# EAGLE design fisk-batt-5 (EAGLE 7.6.0)
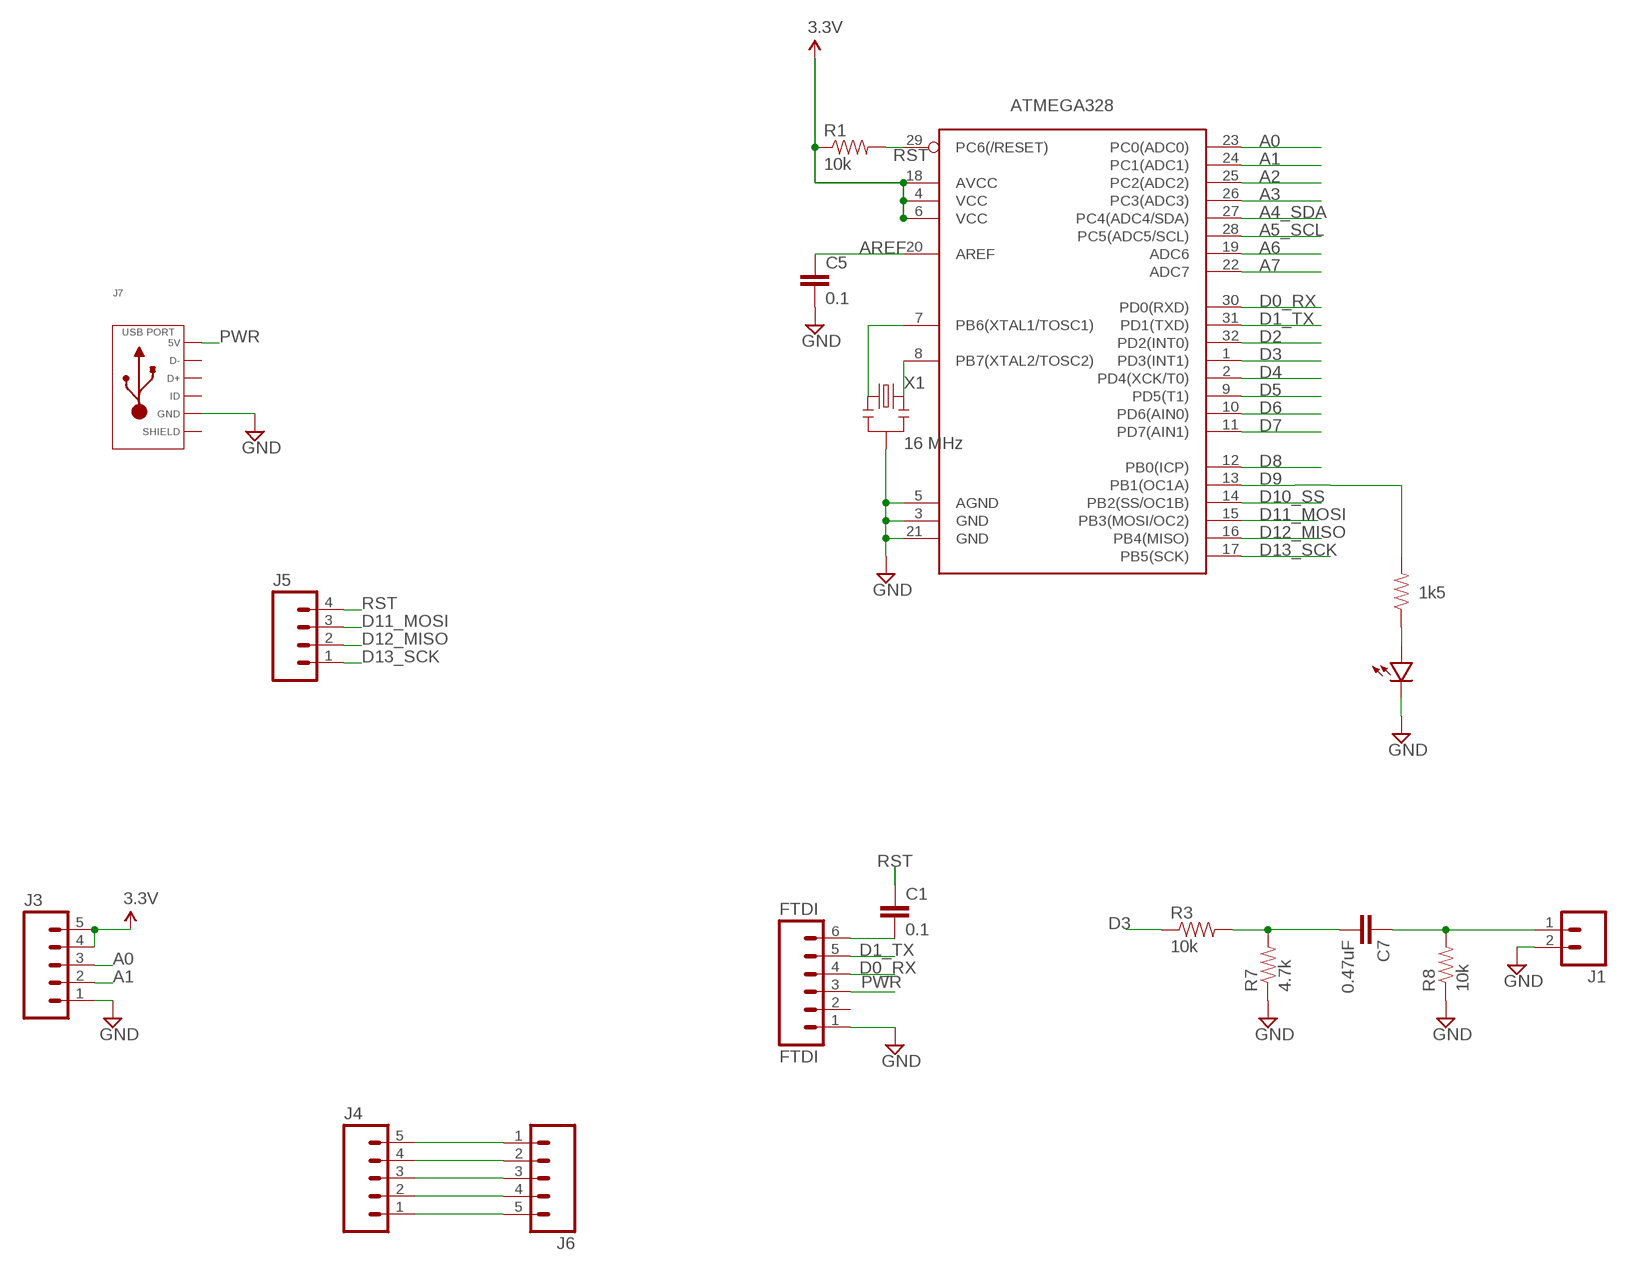
[diagram p0: schematic, sheet 1, part 1 of 2]
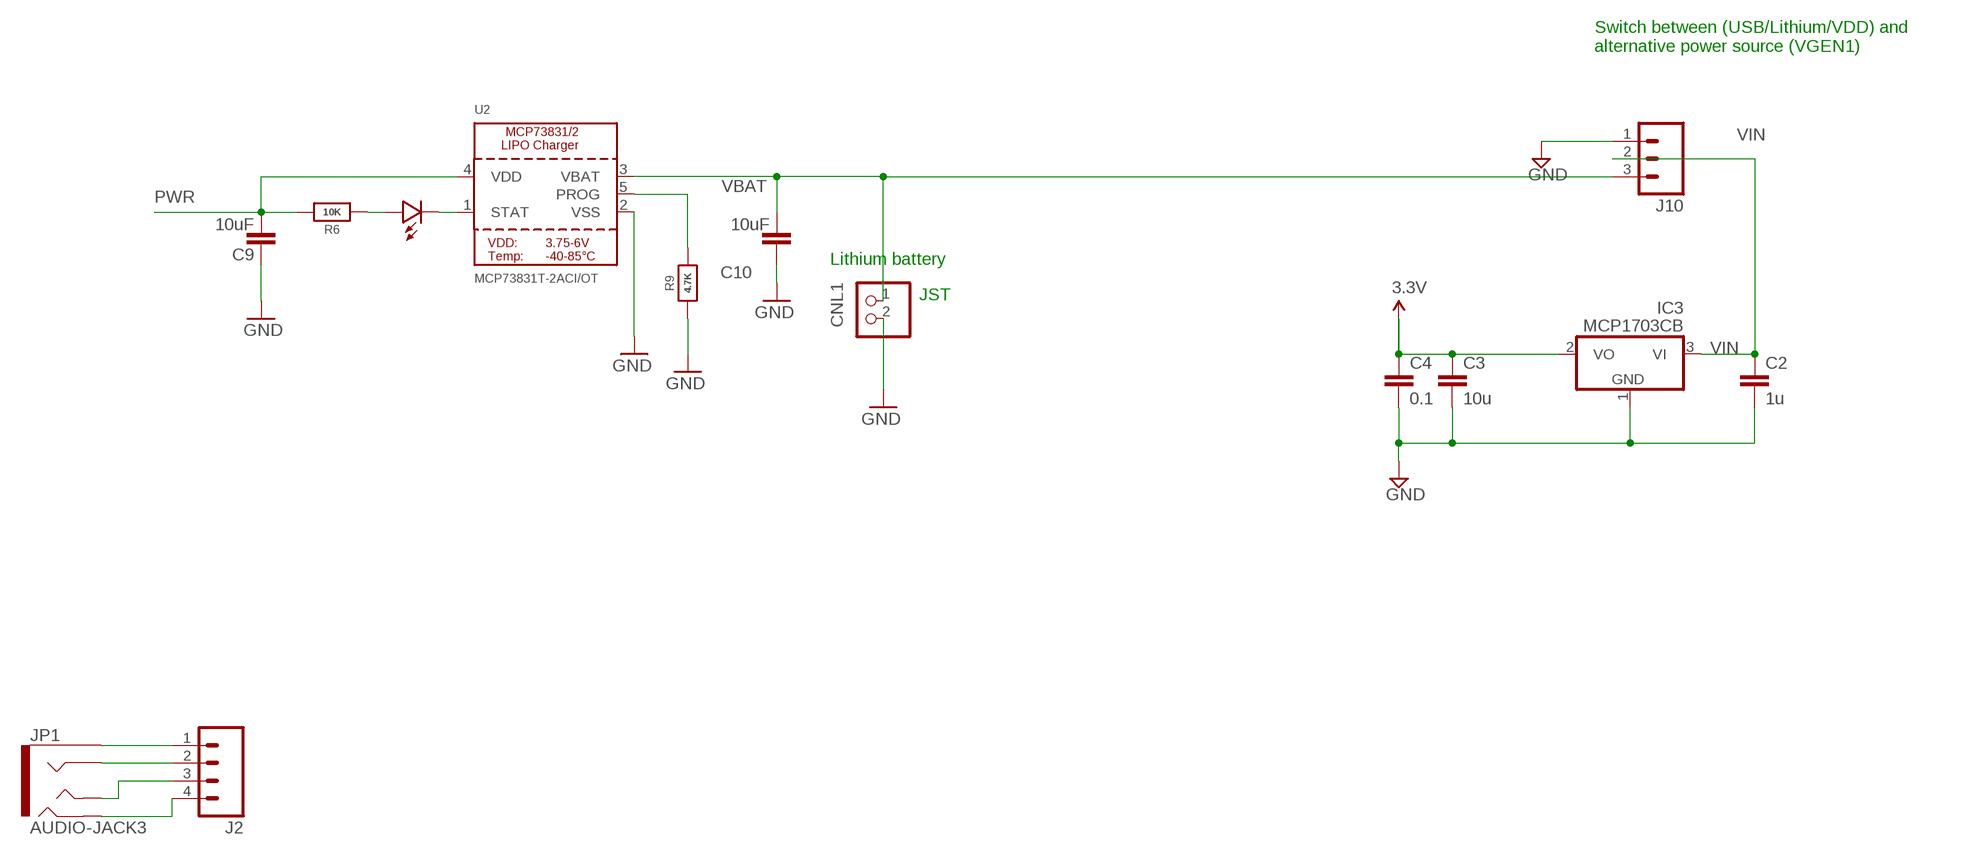
[diagram p1: schematic, sheet 1, part 2 of 2]

## Parts
ATMEGA328  ATMega-328  ATMEGA168/328TQFP32  [TQFP32-08]
C1  0.1  CAP0603-CAP  [0603-CAP]
C2  1u  CAP0603-CAP  [0603-CAP]
C3  10u  CAP0805-CAP  [0805-CAP]
C4  0.1  CAP0603-CAP  [0603-CAP]
C5  0.1  CAP0603-CAP  [0603-CAP]
C7  0.47uF  CAP0603-CAP  [0603-CAP]
C9  10uF  CAP0603-CAP  [0603-CAP]
C10  10uF  CAP0603-CAP  [0603-CAP]
CNL1  JST_2PIN-SMT-RA  [JST-PH-2-SMT-RA]
D2  LED0603  [0603-LED]
FTDI  FTDI  M06SIP  [1X06]
IC3  MCP1703CB  [SOT23]
J1  M02PTH  [1X02]
J2  M04PTH  [1X04]
J3  M05PTH  [1X05]
J4  M05PTH  [1X05]
J5  M04PTH  [1X04]
J6  M05SCREW  [SCREWTERMINAL-3.5MM-5]
J7  USB_MICRO_RIGHT  [MICROUSB-RIGHT]
J10  M03PTH  [1X03]
JP1  AUDIO-JACK3  [AUDIO-JACK-TRRS-SMD]
R1  10k  RESISTOR0603-RES  [0603-RES]
R2  1k5  RESISTOR0603-RES  [0603-RES]
R3  10k  RESISTOR0603-RES  [0603-RES]
R6  10K  RESISTOR_0603_NOOUT  [0603-NO]
R7  4.7k  RESISTOR0603-RES  [0603-RES]
R8  10k  RESISTOR0603-RES  [0603-RES]
R9  4.7K  RESISTOR_0603_NOOUT  [0603-NO]
U2  MCP73831T-2ACI/OT  MCP73831/2  [SOT23-5]
U$2  LED0603  [0603-LED]
X1  16 MHz  RESONATORSMD  [RESONATOR-SMD]

## Nets
A0: ATMEGA328.23(PC0(ADC0)) J3.3
A1: ATMEGA328.24(PC1(ADC1)) J3.2
A2: ATMEGA328.25(PC2(ADC2))
A3: ATMEGA328.26(PC3(ADC3))
A4_SDA: ATMEGA328.27(PC4(ADC4/SDA))
A5_SCL: ATMEGA328.28(PC5(ADC5/SCL))
A6: ATMEGA328.19(ADC6)
A7: ATMEGA328.22(ADC7)
AREF: ATMEGA328.20(AREF) C5.1
D0_RX: ATMEGA328.30(PD0(RXD)) FTDI.4
D1_TX: ATMEGA328.31(PD1(TXD)) FTDI.5
D2: ATMEGA328.32(PD2(INT0))
D3: ATMEGA328.1(PD3(INT1)) R3.1
D4: ATMEGA328.2(PD4(XCK/T0))
D5: ATMEGA328.9(PD5(T1))
D6: ATMEGA328.10(PD6(AIN0))
D7: ATMEGA328.11(PD7(AIN1))
D8: ATMEGA328.12(PB0(ICP))
D9: ATMEGA328.13(PB1(OC1A)) R2.2
D10_SS: ATMEGA328.14(PB2(SS/OC1B))
D11_MOSI: ATMEGA328.15(PB3(MOSI/OC2)) J5.3
D12_MISO: ATMEGA328.16(PB4(MISO)) J5.2
D13_SCK: ATMEGA328.17(PB5(SCK)) J5.1
GND [power]: ATMEGA328.3(GND) ATMEGA328.5(AGND) ATMEGA328.21(GND) C2.2 C3.2 C4.2 C5.2 C9.2 C10.2 CNL1.2 FTDI.1 IC3.1(GND) J1.2 J3.1 J7.5(GND) J10.1 R7.1 R8.1 R9.1 U2.2(VSS) U$2.MINUS X1.2
N$1: ATMEGA328.7(PB6(XTAL1/TOSC1)) X1.1
N$2: R2.1 U$2.PLUS
N$3: C7.2 R3.2 R7.2
N$4: C7.1 J1.1 R8.2
N$5: J2.1 JP1.EARTH
N$6: J2.2 JP1.RING1
N$7: J2.3 JP1.TIP
N$8: J2.4 JP1.RING2
N$9: J4.5 J6.1
N$10: J4.4 J6.2
N$11: J4.3 J6.3
N$12: J4.2 J6.4
N$13: J4.1 J6.5
N$16: R9.2 U2.5(PROG)
N$17: D2.MINUS U2.1(STAT)
N$18: D2.PLUS R6.1
N$20: C1.2 FTDI.6
N$21: ATMEGA328.8(PB7(XTAL2/TOSC2)) X1.3
PWR [power]: C9.1 FTDI.3 J7.1(5V) R6.2 U2.4(VDD)
RST: ATMEGA328.29(PC6(/RESET)) C1.1 J5.4 R1.2
VBAT [power]: C10.1 CNL1.1 J10.3 U2.3(VBAT)
VCC: ATMEGA328.4(VCC) ATMEGA328.6(VCC) ATMEGA328.18(AVCC) C3.1 C4.1 IC3.2(VO) J3.4 J3.5 R1.1 ; supply symbol labelled 3.3V
VIN: C2.1 IC3.3(VI) J10.2
Unconnected: FTDI.2 J7.2(D-) J7.3(D+) J7.4(ID)

## Notes on the sheet
- Switch between (USB/Lithium/VDD) and 
  alternative power source (VGEN1)
- Lithium battery
- JST

## Power pins joined to a net without a drawn wire
SLD: J7.S1(SLD) J7.S2(SLD) J7.S3(SLD) J7.S4(SLD) J7.S5(SLD) J7.S6(SLD) J7.S7(SLD) J7.S8(SLD)

## Library data of the parts
ATMEGA328 = LowPowerLab:ATMEGA168/328: Atmel 32-pin 8-bit micro, 16k flash.
C1-C5 C7 = LowPowerLab:CAP: Capacitor Standard 0603 ceramic capacitor, and 0.1" leaded capacitor.
C9 C10 = SparkFun:CAP: Capacitor Standard 0603 ceramic capacitor, and 0.1" leaded capacitor.
CNL1 = adafruit:JST_2PIN: JST 2-Pin Connectors of various flavors SMT-RA (S2B-PH-SM4) 4UConnector #17311 SMT (B2B-PH-SM4) THM-RA (S2B-PH) THM (B2B-PH)
D2 U$2 = LowPowerLab:LED
FTDI = SparkFun-Connectors:M06: Header 6 Standard 6-pin 0.1" header. Use with straight break away headers (SKU : PRT-00116), right angle break away headers (PRT-00553), swiss pins (PRT-00743), machine pins (PRT-00117), and female headers (PRT-00115). Molex polarized connector foot print use with SKU : PRT-08094 with associated crimp pins and housings. NOTES ON THE VARIANTS LOCK and LOCK_LONGPADS... This footprint was designed to help hold the alignment of a through-hole component (i.e. 6-pin header) while soldering it into place. You may notice that each hole has been shifted either up or down by 0.005 of an inch from it's more standard position (which is a perfectly straight line). This slight alteration caused the pins (the squares in the middle) to touch the edges of the holes. Because they are alternating, it causes a "brace" to hold the component in place. 0.005 has proven to be the perfect amount of "off-center" position when using our standard breakaway headers. Although looks a little odd when you look at the bare footprint, once you have a header in there, the alteration is very hard to notice. Also, if you push a header all the way into place, it is covered up entirely on the bottom side. This idea of altering the position of holes to aid alignment will be further integrated into the Sparkfun Library for other footprints. It can help hold any component with 3 or more connection pins.
IC3 = linear:MCP1703: 250 mA, 16V, Low Quiescent Current LDO Regulator Source: http://ww1.microchip.com/downloads/en/DeviceDoc/22049b.pdf
J1 = SparkFun-Connectors:M02: Standard 2-pin 0.1" header. Use with - straight break away headers ( PRT-00116) - right angle break away headers (PRT-00553) - swiss pins (PRT-00743) - machine pins (PRT-00117) - female headers (PRT-00115) Molex polarized connector foot print use with: PRT-08233 with associated crimp pins and housings. 2.54_SCREWTERM for use with PRT-10571. 3.5mm Screw Terminal footprints for PRT-08084 5mm Screw Terminal footprints for use with PRT-08432
J2 J5 = SparkFun-Connectors:M04: Header 4 Standard 4-pin 0.1" header. Use with straight break away headers (SKU : PRT-00116), right angle break away headers (PRT-00553), swiss pins (PRT-00743), machine pins (PRT-00117), and female headers (PRT-00115). Molex polarized connector foot print use with SKU : PRT-08231 with associated crimp pins and housings. 1MM SMD Version SKU: PRT-10208; PROD_ID: CONN-09696
J3 J4 = SparkFun-Connectors:M05: Header 5 Standard 5-pin 0.1" header. Use with straight break away headers (SKU : PRT-00116), right angle break away headers (PRT-00553), swiss pins (PRT-00743), machine pins (PRT-00117), and female headers (PRT-00115). Molex polarized connector foot print use with SKU : PRT-08230 with associated crimp pins and housings.
J6 = SparkFun-Connectors:M05: Header 5 Standard 5-pin 0.1" header. Use with straight break away headers (SKU : PRT-00116), right angle break away headers (PRT-00553), swiss pins (PRT-00743), machine pins (PRT-00117), and female headers (PRT-00115). Molex polarized connector foot print use with SKU : PRT-08230 with associated crimp pins and housings.; PROD_ID: Combine 8288+8399
J7 = MF_Connectors:USB: Library: MF_Connectors Description: 5 Pin USB Connectors. SLD is the shield connection. Usually tied to ground through a small ferrite bead.
J10 = SparkFun-Connectors:M03: Header 3 Standard 3-pin 0.1" header. Use with straight break away headers (SKU : PRT-00116), right angle break away headers (PRT-00553), swiss pins (PRT-00743), machine pins (PRT-00117), and female headers (PRT-00115). Molex polarized connector foot print use with SKU : PRT-08232 with associated crimp pins and housings.
JP1 = SparkFun-Connectors:AUDIO-JACK3: Audio jack - 3.5mm TRRS variety - two rings.
R1-R3 R7 R8 = LowPowerLab:RESISTOR: Resistor Basic schematic elements and footprints for 0603, 1206, and PTH resistors.
R6 R9 = microbuilder:RESISTOR: Resistors For new designs, use the packages preceded by an '_' character since they are more reliable: The following footprints should be used on most boards: _0402 - Standard footprint for regular board layouts _0603 - Standard footprint for regular board layouts _0805 - Standard footprint for regular board layouts _1206 - Standard footprint for regular board layouts For extremely tight-pitch boards where space is at a premium, the following 'micro-pitch' footprints can be used (smaller pads, no silkscreen outline, etc.): _0402MP - Micro-pitch footprint for very dense/compact boards _0603MP - Micro-pitch footprint for very dense/compact boards _0805MP - Micro-pitch footprint for very dense/compact boards _1206MP - Micro-pitch footprint for very dense/compact boards
U2 = microbuilder:MCP73831/2: MCP73831/2 LIPO Charger VDD: 3.75 - 6V Temp -40 - 85°C Programmable Charge Rate: 15-500mA NOTE: STAT is a tri-state logic output on the MCP73831 and an open-drain output on the MCP73832. SOT23-5 with 4.2V output and tri-state logic on STAT = MCP73831T-2ACI/OT
X1 = SparkFun:RESONATOR: Resonator Small SMD resonator. This is the itty bitty 10/20MHz resonators with built in caps. CSTCE10M0G55 and CSTCE20M0V53. Footprint has been reviewed closely but hasn't been tested yet.

## Net classes
1 power: width 0.305 mm

## Board
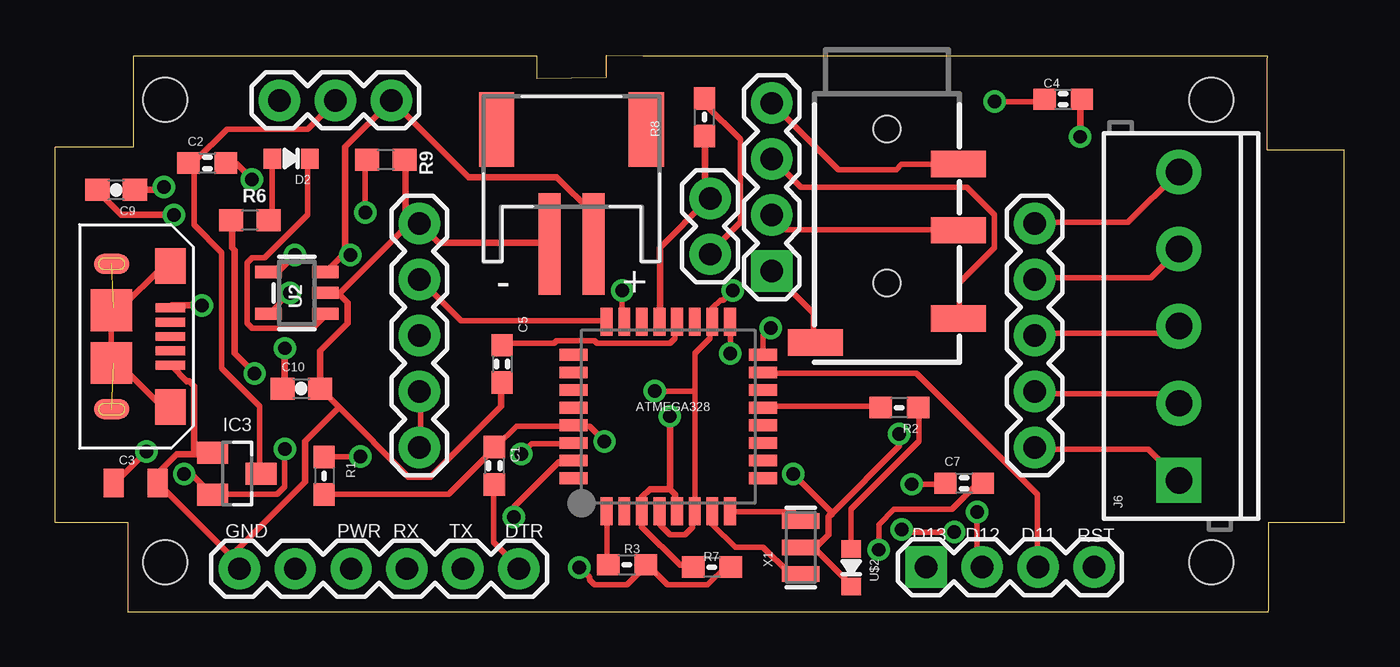
[diagram p2: board, top side]
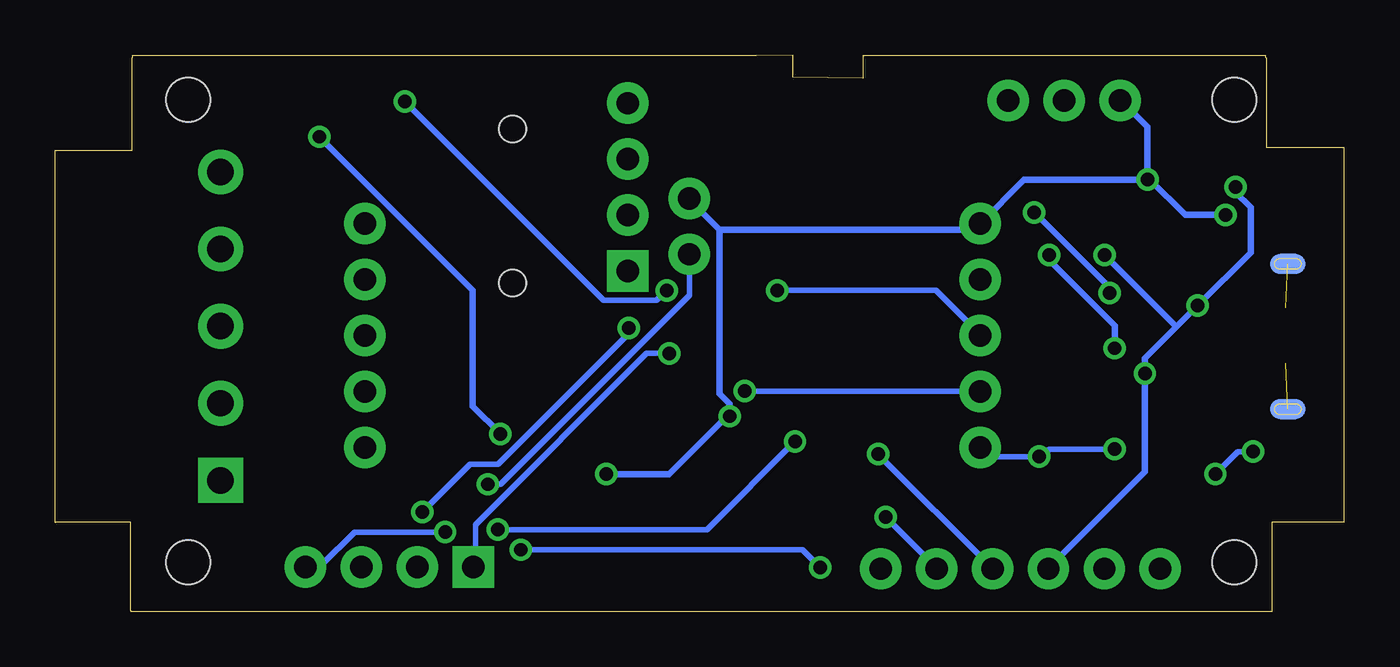
[diagram p3: board, bottom side, seen from below]

Size 58.55 x 25.28 mm. Coordinates in mm from the lower left corner, seen from the top.
Outline: 3.3,0 3.3,4.06 0,4.06 0,21.08 3.56,21.08 3.56,25.15
Outline: 55.12,0.05 55.12,4.06 58.55,4.06
Outline: 58.55,4.06 58.55,4.05
Outline: 3.3,0 55.1,0 55.1,0.05
Outline: 58.55,4.06 58.55,20.95 55.05,20.95 55.05,25.15
Outline: 3.56,25.15 3.56,25.25 21.88,25.25 21.88,24.23 25.05,24.26 25.05,25.28 26.7,25.25 55.05,25.25 55.05,25.15
Copper layers (1*16): Top 0.035mm / dielectric 1.5mm / Bottom 0.035mm
Design rules "default": minimum track width 10mil, minimum drill 24mil, track to track 8mil, track to pad 8mil, pad to pad 8mil, via to via 8mil, smd to smd 8mil, copper to edge 40mil, drill to drill 8mil, minimum pad ring 10mil, minimum via ring 8mil, stop-mask expansion 4mil, vias tented up to drill 0mil, thermal gap 10mil
Holes 2 mm at 5,2.25 5,23.25 52.5,2.25 52.5,23.25

### Footprints (pad centres in the part's own frame; a part is rotated, then mirrored left to right if it is on the bottom)
TQFP32-08 = smd 1.27 x 0.533: 1 -4.293,2.8; 2 -4.293,2; 3 -4.293,1.2; 4 -4.293,0.4; 5 -4.293,-0.4; 6 -4.293,-1.2; 7 -4.293,-2; 8 -4.293,-2.8; 17 4.293,-2.8; 18 4.293,-2; 19 4.293,-1.2; 20 4.293,-0.4; 21 4.293,0.4; 22 4.293,1.2; 23 4.293,2; 24 4.293,2.8 | smd 0.533 x 1.27: 9 -2.8,-4.293; 10 -2,-4.293; 11 -1.2,-4.293; 12 -0.4,-4.293; 13 0.4,-4.293; 14 1.2,-4.293; 15 2,-4.293; 16 2.8,-4.293; 25 2.8,4.293; 26 2,4.293; 27 1.2,4.293; 28 0.4,4.293; 29 -0.4,4.293; 30 -1.2,4.293; 31 -2,4.293; 32 -2.8,4.293
0603-CAP = smd 1.016 x 0.965: 1 -0.85,0; 2 0.85,0
0805-CAP = smd 0.902 x 1.3: 1 -1,0; 2 1,0
0603-CAP' = smd 1.1 x 1: 1 -0.85,0; 2 0.85,0
JST-PH-2-SMT-RA = smd 1 x 4.6: 1 1,-3.7; 2 -1,-3.7 | smd 1.6 x 3.4: NC1 -3.4,1.5; NC2 3.4,1.5
0603-LED = smd 0.8 x 0.9: MINUS -0.85,0; PLUS 0.85,0
1X06 = drill 1.016 pad 1.88: 1 0,0; 2 2.54,0; 3 5.08,0; 4 7.62,0; 5 10.16,0; 6 12.7,0
SOT23 = smd 1 x 1.4: 1 -0.95,-1.1; 2 0.95,-1.1; 3 0,1.1
1X02 = drill 1.016 pad 1.88: 1 0,0; 2 2.54,0
1X04 = drill 1.016 pad 1.88 square: 1 0,0 | drill 1.016 pad 1.88: 2 2.54,0; 3 5.08,0; 4 7.62,0
1X05 = drill 1.016 pad 1.88: 1 0,0; 2 2.54,0; 3 5.08,0; 4 7.62,0; 5 10.16,0
SCREWTERMINAL-3.5MM-5 = drill 1.2 pad 2.032 square: 1 0,0 | drill 1.2 pad 2.032: 2 3.5,0; 3 7,0; 4 10.5,0; 5 14,0
MICROUSB-RIGHT = smd 0.4 x 1.35: 1 -1.3,1.27; 2 -0.65,1.27; 3 0,1.27; 4 0.65,1.27; 5 1.3,1.27 | smd 0.9 x 1.6: S1 -3.3,-1.4; S2 3.3,-1.4 | smd 1.6 x 1.4: S3 -3.2,1.27; S4 3.2,1.27 | smd 1.9 x 1.9: S5 -1.2,-1.405; S6 1.2,-1.405 | smd 0.9 x 1.6 bottom: S7 -3.3,-1.4; S8 3.3,-1.4
1X03 = drill 1.016 pad 1.88: 1 0,0; 2 2.54,0; 3 5.08,0
AUDIO-JACK-TRRS-SMD = smd 1.2 x 2.5: EARTH 11.3,-3.25; RING1 6.2,3.25; RING2 3.2,3.25; TIP 10.2,3.25 | hole 1.2: 1.6,0; 8.6,0
0603-RES = smd 1.016 x 0.965: 1 -0.85,0; 2 0.85,0
0603-NO = smd 1.1 x 1: 1 -0.85,0; 2 0.85,0
SOT23-5 = smd 0.55 x 1.2: 1 -0.95,-1.3; 2 0,-1.3; 3 0.95,-1.3; 4 0.95,1.3; 5 -0.95,1.3
RESONATOR-SMD = smd 0.7 x 1.7: 1 -1.2,0; 2 0,0; 3 1.2,0

### Placement (x,y rotation side)
ATMEGA328  27.84,8.87 90 top
C1  19.95,6.63 270 top
C2  6.92,20.37 0 top
C3  3.66,5.84 0 top
C4  45.78,23.27 0 top
C5  20.3,11.25 270 top
C7  41.28,5.84 0 top
C9  10uF  [0603-CAP']  2.77,19.15 180 top
C10  10uF  [0603-CAP']  11.18,10.14 0 top
CNL1  23.45,20.4 0 top
D2  10.73,20.58 180 top
FTDI  8.36,1.96 0 top
IC3  8.26,6.28 270 top
J1  29.75,16.23 90 top
J2  32.54,15.47 90 top
J3  16.54,17.63 270 top
J4  44.48,17.63 270 top
J5  39.55,2.03 0 top
J6  51.03,5.97 90 top
J7  3.97,12.5 270 top
J10  10.19,23.22 0 top
JP1  37.78,23.52 270 top
R1  12.22,6.17 270 top
R2  38.33,9.27 180 top
R3  25.97,2.14 0 top
R6  8.85,17.78 180 top
R7  29.83,2.03 0 top
R8  29.5,22.46 90 top
R9  15.02,20.53 180 top
U2  10.98,14.48 90 top
U$2  36.15,2.01 90 top
X1  33.86,2.92 90 top

### Tracks (layer width: path | path; a pad name or v marks a point on that pad's centre or on a via)
A0  (via drill 0.61)
  Top 0.254: v25.75,14.59 25.75,13.22 ATMEGA328.23
  Bottom 0.254: v25.75,14.59 18.55,14.59 16.6,12.65 J3.3
A1
  Top 0.254: ATMEGA328.24 24.95,13.22 18.43,13.22 16.6,15.05 J3.2
AREF
  Top 0.254: C5.1 20.38,12.19 22.66,12.19 22.78,12.31 24.49,12.31 24.61,12.19 27.92,12.19 28.15,12.42 28.15,13.11 ATMEGA328.20
D0_RX  (via drill 0.61)
  Top 0.254: v21.18,7.17 21.63,7.62 23.46,7.62 ATMEGA328.30
  Bottom 0.254: v21.18,7.17 16.03,2.02 FTDI.4
D1_TX  (via drill 0.61)
  Top 0.254: v20.83,4.31 20.83,4.76 22.89,6.82 23.46,6.82 ATMEGA328.31
  Bottom 0.254: v20.83,4.31 18.55,2.02 FTDI.5
D3
  Top 0.254: R3.1 25.06,2.14 25.06,4.54 ATMEGA328.1
D9
  Top 0.254: R2.2 37.41,9.34 32.15,9.34 ATMEGA328.13
D11_MOSI
  Top 0.254: ATMEGA328.15 32.15,10.82 39.12,10.82 44.61,5.34 44.61,2.14 J5.3
D12_MISO  (via drill 0.61)
  Top 0.254: v32.49,12.88 32.15,12.54 32.15,11.74 ATMEGA328.16 | v41.87,4.54 41.87,2.37 42.09,2.14 J5.2
  Bottom 0.254: v32.49,12.88 32.49,12.65 38.44,6.71 39.69,6.71 v41.87,4.54
D13_SCK  (via drill 0.61)
  Top 0.254: v30.66,11.74 30.66,13.11 ATMEGA328.17
  Bottom 0.254: v30.66,11.74 31.69,11.74 39.47,3.97 39.47,2.14 J5.1
GND  (via drill 0.61)
  Top 0.305: U$2.MINUS 36.15,1.22 34.55,2.82 33.86,2.82 X1.2 34.55,2.94 35.12,3.51 35.12,4.31 35.29,4.48 | v46.55,21.57 46.55,23.17 C4.2 | v38.32,8.08 38.32,7.51 35.29,4.48 | R7.1 28.95,2.14 28.38,2.14 26.66,3.85 26.66,4.54 ATMEGA328.3 26.66,4.65 26.66,5.22 27.01,5.56 27.92,5.56 | 27.92,5.56 28.15,5.34 28.15,4.65 ATMEGA328.5 | R8.1 29.52,21.57 29.52,19.05 29.75,18.82 J1.2 29.64,18.71 27.46,16.54 27.46,13.22 ATMEGA328.21 | v27.92,8.88 27.92,5.56 | 6.32,7.17 7.12,7.17 IC3.1 | 6.32,7.17 5.52,7.17 4.72,6.36 4.72,5.91 C3.2 4.72,5.79 8.26,2.25 8.26,2.02 FTDI.1 8.03,2.59 11.35,5.91 11.35,7.74 12.89,9.28 | 6.32,7.17 6.32,10.25 6.09,10.48 5.98,10.48 5.29,11.17 J7.5 | v8.95,19.62 8.26,20.31 7.8,20.31 C2.2 | v5.4,18.02 3,18.02 1.97,19.05 C9.2 | 12.89,9.28 C10.2 12.03,10.25 12.03,11.85 13.29,13.11 13.29,14.02 12.95,14.37 12.95,14.48 | 12.89,9.28 16.03,6.14 17.06,6.14 20.26,9.34 20.26,10.37 C5.2 | J3.1 15.92,18.25 15.92,20.42 R9.1 | 12.95,14.48 U2.2 | 12.95,14.48 16.26,17.8 J3.1 | J3.1 17.41,16.77 22.43,16.77 CNL1.2 | v33.52,6.25 35.29,4.48
  Bottom 0.305: v46.55,21.57 39.58,14.59 39.58,9.34 v38.32,8.08 | 28.38,17.34 28.38,9.91 27.92,9.45 v27.92,8.88 28.03,8.88 30.66,6.25 v33.52,6.25 | 28.38,17.34 29.75,18.71 J1.2 | v8.95,19.62 8.95,22.02 10.09,23.17 J10.1 | v5.4,18.02 7.23,18.02 8.83,19.62 v8.95,19.62 | v8.95,19.62 14.55,19.62 J3.1 16.83,17.34 28.38,17.34
N$1
  Top 0.254: ATMEGA328.7 29.86,4.54 29.86,3.97 30.89,2.94 32.15,2.94 33.29,1.79 33.86,1.79 X1.1
N$2
  Top 0.254: U$2.PLUS 36.15,4.65 39.24,7.74 39.24,9.22 R2.1
N$3  (via drill 0.61)
  Top 0.254: R7.2 30.44,2.02 29.64,1.22 27.81,1.22 26.89,2.14 R3.2 26.78,2.02 25.98,1.22 24.49,1.22 24.26,1.45 24.26,1.56 v23.81,2.02 | v37.41,2.82 37.41,3.97 38.09,4.65 40.72,4.65 41.87,5.79 42.09,5.79 C7.2
  Bottom 0.254: v37.41,2.82 24.61,2.82 v23.81,2.02
N$4  (via drill 0.61)
  Top 0.254: R8.2 29.52,23.28 29.52,23.05 31.12,21.45 31.12,17.68 29.75,16.31 J1.1 | v38.89,5.79 40.38,5.79 C7.1
  Bottom 0.254: v38.89,5.79 38.32,5.79 29.75,14.37 J1.1
N$5
  Top 0.254: JP1.EARTH 34.44,12.31 34.44,13.57 32.61,15.39 J2.1
N$6
  Top 0.254: JP1.RING1 40.95,17.34 33.18,17.34 32.61,17.91 J2.2
N$7
  Top 0.254: JP1.TIP 41.07,13.34 41.07,14.94 42.67,16.54 42.67,18.02 41.41,19.28 33.86,19.28 32.61,20.54 J2.3
N$8
  Top 0.254: JP1.RING2 40.95,20.31 38.44,20.31 38.21,20.08 35.58,20.08 32.61,23.05 J2.4
N$9
  Top 0.254: J4.5 44.49,7.39 49.64,7.39 51.01,6.02 J6.1
N$10
  Top 0.254: J4.4 44.49,9.91 50.67,9.91 51.01,9.57 J6.2
N$11
  Top 0.254: J4.3 44.49,12.65 50.78,12.65 51.01,12.88 J6.3
N$12
  Top 0.254: J4.2 44.49,15.17 49.75,15.17 51.01,16.42 J6.4
N$13
  Top 0.254: J4.1 44.49,17.68 48.72,17.68 51.01,19.97 J6.5
N$16  (via drill 0.61)
  Top 0.254: v14.09,18.14 14.09,20.42 R9.2 | v10.66,14.48 9.75,13.57 U2.5
  Bottom 0.254: v14.09,18.14 10.66,14.71 v10.66,14.48
N$17
  Top 0.254: D2.MINUS 11.46,20.54 11.46,18.02 9.52,16.08 8.95,16.08 8.72,15.85 8.72,13.11 8.95,12.88 11.69,12.88 12.26,13.45 U2.1
N$18
  Top 0.254: D2.PLUS 9.86,20.54 9.86,17.91 9.75,17.8 R6.1
N$20
  Top 0.254: C1.2 19.92,5.68 19.92,3.17 21.06,2.02 FTDI.6
N$21
  Top 0.254: ATMEGA328.8 30.66,4.54 33.52,4.54 33.86,4.19 X1.3
PWR  (via drill 0.61)
  Top 0.305: v9.06,10.82 8.15,11.74 8.15,16.42 8.03,16.54 8.03,17.68 R6.2 | v4.95,19.28 4.83,19.17 3.69,19.17 C9.1 | v10.89,16.2 10.2,15.51 9.75,15.51 U2.4 | v6.66,13.91 5.29,13.91 J7.1
  Bottom 0.305: FTDI.3 13.4,2.02 9.06,6.36 v9.06,10.82 9.06,11.51 7.63,12.94 | v4.95,19.28 4.95,19.05 4.26,18.37 4.26,16.31 v6.66,13.91 7.63,12.94 | 7.63,12.94 v10.89,16.2
RST  (via drill 0.61)
  Top 0.254: R1.2 12.26,5.34 17.86,5.34 19.92,7.39 C1.1 20.03,7.51 20.95,8.42 23.46,8.42 ATMEGA328.29 23.58,8.42 24.26,8.42 v24.95,7.74 | v40.84,3.62 38.55,3.62 v38.44,3.74
  Bottom 0.254: v40.84,3.62 44.95,3.62 46.44,2.14 47.12,2.14 J5.4 | v38.44,3.74 28.95,3.74 v24.95,7.74
SLD  (4 unrouted)
  Top 0.254: J7.S4 5.18,9.34 4.83,9.34 2.89,11.28 2.66,11.28 J7.S6 2.55,11.39 2.55,13.68 J7.S5 2.66,13.79 3,13.79 4.83,15.62 5.18,15.62 J7.S3
VBAT  (via drill 0.61)
  Top 0.305: v10.43,11.97 10.43,10.14 C10.1 | U2.3 12.38,15.51 13.06,16.2 v13.4,16.2 13.18,16.31 13.18,21.11 15.23,23.17 J10.3 15.35,23.17 18.78,19.74 22.78,19.74 24.38,18.14 24.38,16.77 CNL1.1
  Bottom 0.305: v10.43,11.97 10.43,12.99 13.4,15.97 v13.4,16.2
VCC  (via drill 0.61)
  Top 0.254: v4.15,7.28 2.77,5.91 C3.1 | v5.86,6.25 6.2,6.25 7.12,5.34 IC3.2 7.23,5.34 10.09,5.34 10.43,5.68 v10.43,7.39 | v13.86,7.05 12.26,7.05 R1.1 | J3.4 16.6,9.91 16.6,7.51 J3.5 | ATMEGA328.4 27.46,4.54 27.46,3.97 27.92,3.51 28.61,3.51 28.95,3.85 28.95,4.54 ATMEGA328.6 29.06,4.65 29.06,10.02 | v42.67,23.17 44.84,23.17 C4.1 | v30.78,14.59 30.32,14.14 30.21,14.14 29.86,13.79 29.86,13.22 ATMEGA328.18 29.75,13.11 29.75,12.42 29.06,11.74 29.06,10.02 | 29.06,10.02 v27.23,10.02
  Bottom 0.254: v4.15,7.28 4.83,7.28 v5.86,6.25 | J3.5 16.49,7.39 16.15,7.05 v13.86,7.05 13.75,7.05 13.4,7.39 v10.43,7.39 | v42.67,23.17 33.64,14.14 31.24,14.14 v30.78,14.59 | v27.23,10.02 16.6,10.02 J3.4
VIN
  Top 0.254: J10.2 12.72,23.17 11.46,21.91 7.8,21.91 6.32,20.42 6.09,20.42 C2.1 6.32,20.31 6.32,17.57 7.58,16.31 7.58,11.05 9.29,9.34 9.29,6.36 IC3.3

### Text on the board
tPlace: GND | PWR | RX | TX | DTR | RST | D13 | D12 | D11